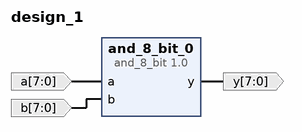
[diagram p0: block diagram of the top level]
# Vivado block design design_1, xc7a35tcpg236-1, Vivado 2025.1
create_bd_design design_1

create_bd_port -dir I -from 7 -to 0 a
create_bd_port -dir I -from 7 -to 0 b
create_bd_port -dir O -from 7 -to 0 y

create_bd_cell -type ip -vlnv xilinx.com:user:and_8_bit:1.0 and_8_bit_0

# ---- connections ----

connect_bd_net -net a_0_1 [get_bd_ports a] [get_bd_pins and_8_bit_0/a]
connect_bd_net [get_bd_pins and_8_bit_0/y] [get_bd_ports y]
connect_bd_net -net b_0_1 [get_bd_ports b] [get_bd_pins and_8_bit_0/b]

validate_bd_design
save_bd_design
